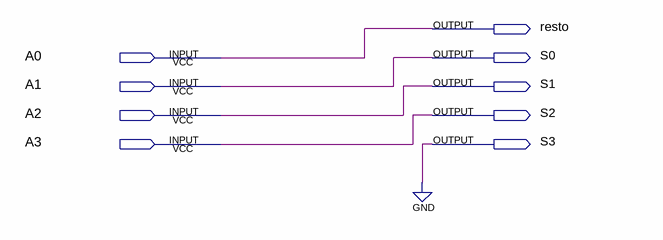
[diagram p0: schematic sheet]
// Quartus schematic divisor.bdf as structural Verilog: 0 symbols, 9 pins
module divisor (
  input  A0,
  input  A1,
  input  A2,
  input  A3,
  output resto,
  output S0,
  output S1,
  output S2,
  output S3
);


  assign resto = A0;
  assign S0 = A1;
  assign S1 = A2;
  assign S2 = A3;
  assign S3 = 1'b0;
endmodule
